# EAGLE schematic stm32f3driver3 (EAGLE 6.6.0)
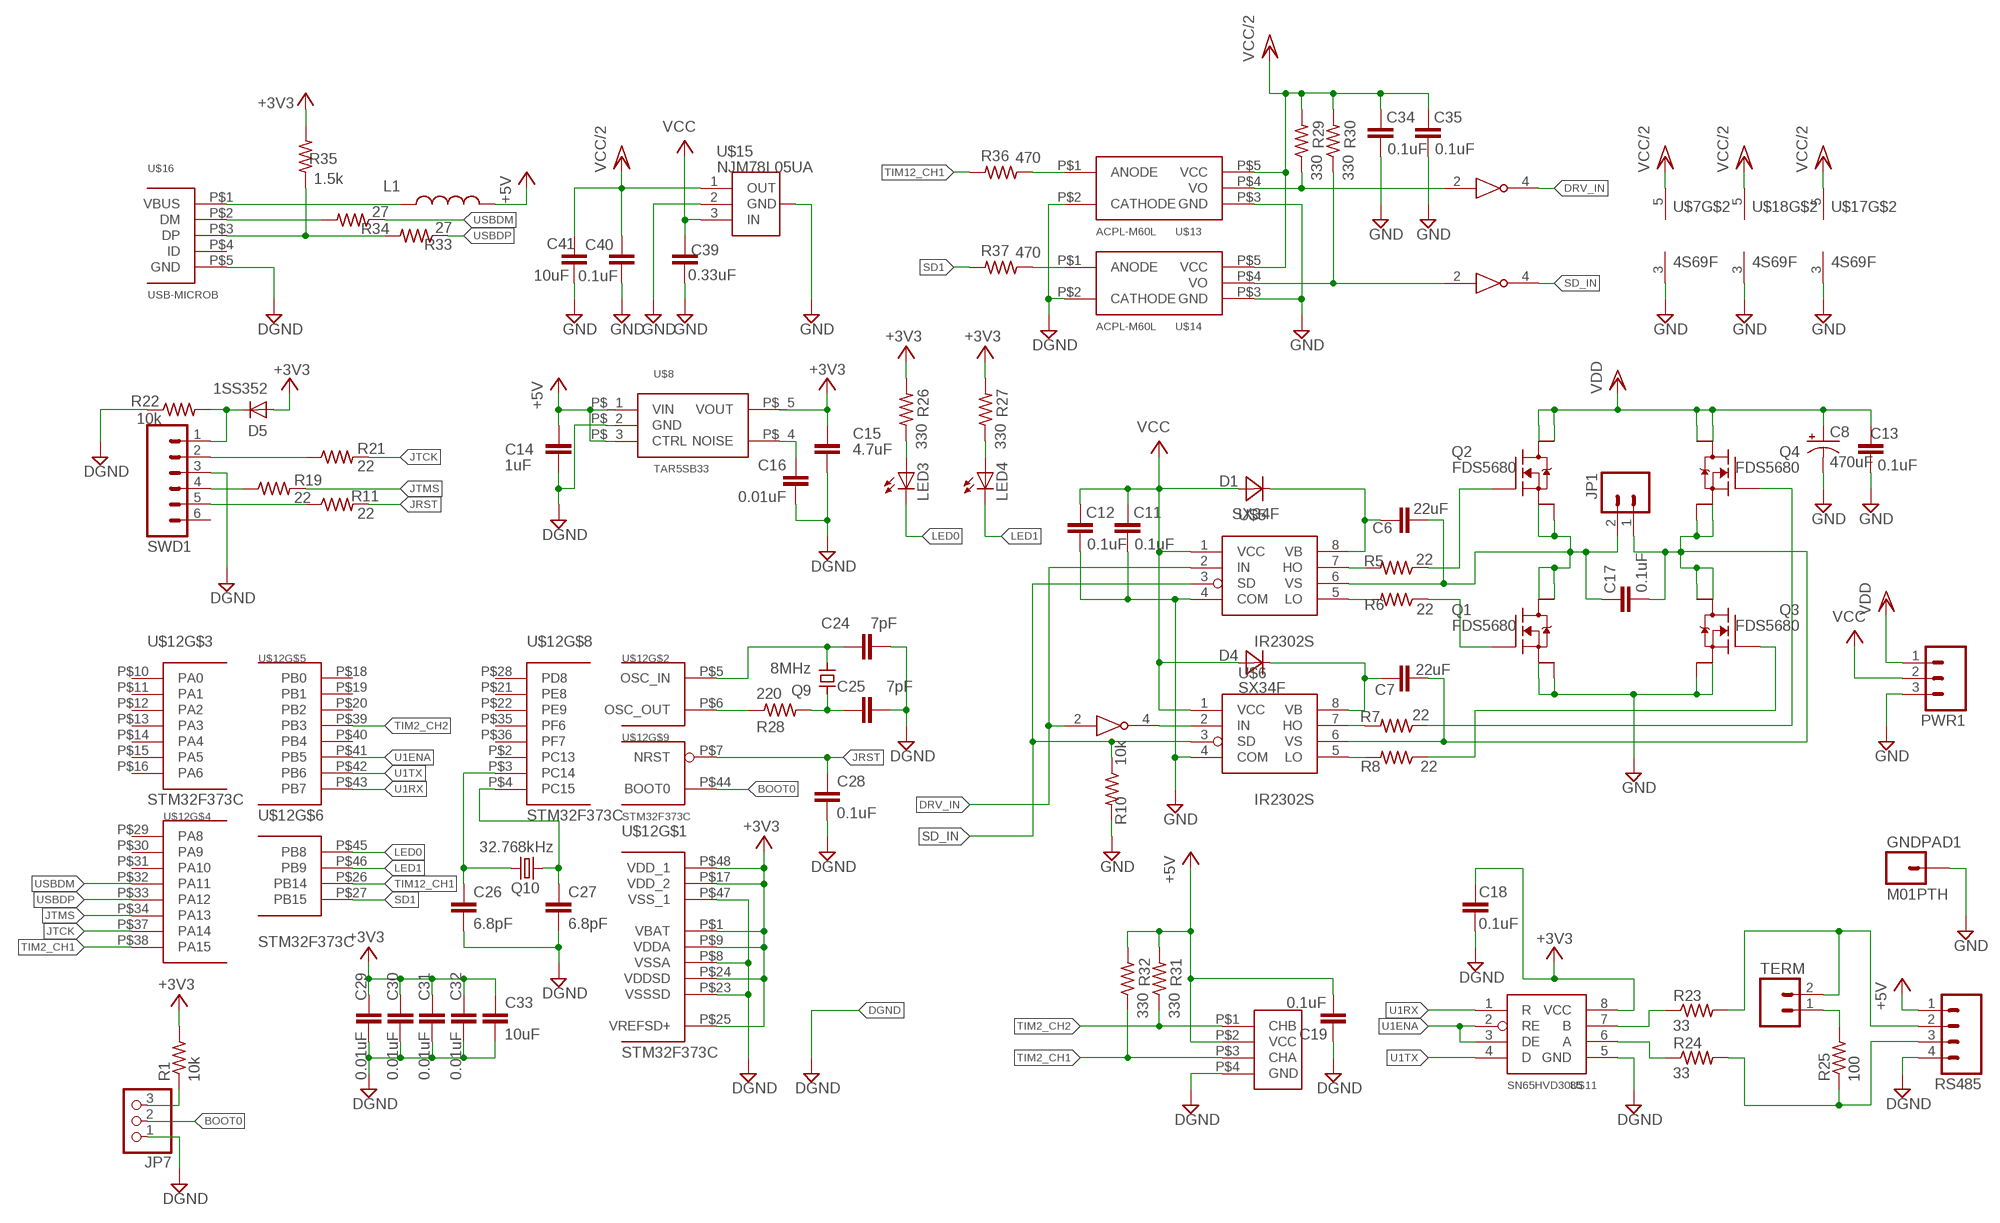
[diagram p0: schematic, sheet 1]

## Parts
C6  22uF  C-EUC3225  [C3225]
C7  22uF  C-EUC3225  [C3225]
C8  470uF  CPOL-USE5-10.5  [E5-10,5]
C11  0.1uF  C-EUC0603  [C0603]
C12  0.1uF  C-EUC0603  [C0603]
C13  0.1uF  C-EUC0603  [C0603]
C14  1uF  C-EUC2012  [C2012]
C15  4.7uF  C-EUC2012  [C2012]
C16  0.01uF  C-EUC0603  [C0603]
C17  0.1uF  C-EUC0603  [C0603]
C18  0.1uF  C-EUC1608  [C1608]
C19  0.1uF  C-EUC0603  [C0603]
C24  7pF  C-EUC0603  [C0603]
C25  7pF  C-EUC0603  [C0603]
C26  6.8pF  C-EUC0603  [C0603]
C27  6.8pF  C-EUC0603  [C0603]
C28  0.1uF  C-EUC0603  [C0603]
C29  0.01uF  C-EUC0603  [C0603]
C30  0.01uF  C-EUC0603  [C0603]
C31  0.01uF  C-EUC0603  [C0603]
C32  0.01uF  C-EUC0603  [C0603]
C33  10uF  C-EUC3216  [C3216]
C34  0.1uF  C-EUC0603  [C0603]
C35  0.1uF  C-EUC0603  [C0603]
C39  0.33uF  C-EUC0805  [C0805]
C40  0.1uF  C-EUC0603  [C0603]
C41  10uF  C-EUC3216  [C3216]
D1  SX34F  MBRA340T3  [SMA]
D4  SX34F  MBRA340T3  [SMA]
D5  1SS352  DIODESOD  [SOD-323]
GNDPAD1  M01PTH  [1X01]
JP1  M02PTH3  [1X02_LONGPADS]
JP7  PINHD-1X3  [1X03]
L1  L-USL3216C  [L3216C]
LED3  LED0603  [LED-0603]
LED4  LED0603  [LED-0603]
PWR1  M03LONGPADS  [1X03_LONGPADS]
Q1  FDS5680  [1206-8CHIP-FET]
Q2  FDS5680  [1206-8CHIP-FET]
Q3  FDS5680  [1206-8CHIP-FET]
Q4  FDS5680  [1206-8CHIP-FET]
Q9  8MHz  NX5032GA  [SMD5032]
Q10  32.768kHz  CRYSTALTC26H  [TC26H]
R1  10k  R-US_R0603  [R0603]
R5  22  R-US_R0603  [R0603]
R6  22  R-US_R0603  [R0603]
R7  22  R-US_R0603  [R0603]
R8  22  R-US_R0603  [R0603]
R10  10k  R-US_R0603  [R0603]
R11  22  R-US_R0603  [R0603]
R19  22  R-US_R0603  [R0603]
R21  22  R-US_R0603  [R0603]
R22  10k  R-US_R0603  [R0603]
R23  33  R-US_R0603  [R0603]
R24  33  R-US_R0603  [R0603]
R25  100  R-US_R0603  [R0603]
R26  330  R-US_R0603  [R0603]
R27  330  R-US_R0603  [R0603]
R28  220  R-US_R0603  [R0603]
R29  330  R-US_R0603  [R0603]
R30  330  R-US_R0603  [R0603]
R31  330  R-US_R0603  [R0603]
R32  330  R-US_R0603  [R0603]
R33  27  R-US_R0603  [R0603]
R34  27  R-US_R0603  [R0603]
R35  1.5k  R-US_R0603  [R0603]
R36  470  R-US_R0603  [R0603]
R37  470  R-US_R0603  [R0603]
RS485  M04PTH  [1X04]
SWD1  M06SIP  [1X06]
TERM  M02PTH  [1X02]
U$5  IR2302S  [SO8]
U$6  IR2302S  [SO8]
U$7  4S69F  [SOT23-5]
U$8  TAR5SB33  [TAR5SB33]
U$10  HEDS9701-C54  [HEDS9701]
U$11  SN65HVD3085  [SO8]
U$12  STM32F373C  [TQFP48]
U$13  ACPL-M60L  [SO5]
U$14  ACPL-M60L  [SO5]
U$15  NJM78L05UA  [SOT89]
U$16  USB-MICROB  [USB_MICROB]
U$17  4S69F  [SOT23-5]
U$18  4S69F  [SOT23-5]

## Nets
+3V3: C15.1 C18.1 C29.1 C30.1 C31.1 C32.1 C33.1 D5.2(A) R1.2 R26.2 R27.2 R35.2 U$8.P$_5(VOUT) U$11.8(VCC) U$12.P$1(VBAT) U$12.P$9(VDDA) U$12.P$17(VDD_2) U$12.P$24(VDDSD) U$12.P$25(VREFSD+) U$12.P$48(VDD_1)
+5V: C14.1 C19.2 L1.2 R31.2 R32.2 RS485.1 U$8.P$_1(VIN) U$8.P$_3(CTRL) U$10.P$2(VCC)
BOOT0: JP7.2 U$12.P$44(BOOT0)
DGND: C14.2 C15.2 C16.2 C18.2 C19.1 C24.2 C25.2 C26.2 C27.2 C28.2 C29.2 C30.2 C31.2 C32.2 C33.2 JP7.1 R22.1 RS485.4 SWD1.3 U$8.P$_2(GND) U$10.P$4(GND) U$11.5(GND) U$12.P$8(VSSA) U$12.P$23(VSSSD) U$12.P$47(VSS_1) U$13.P$2(CATHODE) U$14.P$2(CATHODE) U$16.P$5(GND)
DRV_IN: U$5.2(IN) U$7.2 U$17.4
GND: C8.- C11.2 C12.2 C13.2 C34.2 C35.2 C39.2 C40.2 C41.2 GNDPAD1.1 PWR1.3 Q1.1(S) Q1.2(S1) Q1.3(S2) Q3.1(S) Q3.2(S1) Q3.3(S2) R10.2 U$5.4(COM) U$6.4(COM) U$7.3(V-) U$13.P$3(GND) U$14.P$3(GND) U$15.2(GND) U$15.2@1(GND2) U$17.3(V-) U$18.3(V-)
JRST: C28.1 R11.2 U$12.P$7(NRST)
JTCK: R21.2 U$12.P$37(PA14)
JTMS: R19.2 U$12.P$34(PA13)
LED0: LED3.C U$12.P$45(PB8)
LED1: LED4.C U$12.P$46(PB9)
N$1: C7.1 D4.C U$6.8(VB)
N$3: C7.2 C17.2 JP1.1 Q3.5(D) Q3.6(D1) Q3.7(D2) Q3.8(D3) Q4.1(S) Q4.2(S1) Q4.3(S2) U$6.6(VS)
N$5: C6.2 C17.1 JP1.2 Q1.5(D) Q1.6(D1) Q1.7(D2) Q1.8(D3) Q2.1(S) Q2.2(S1) Q2.3(S2) U$5.6(VS)
N$6: C6.1 D1.C U$5.8(VB)
N$7: R5.2 U$5.7(HO)
N$10: R6.2 U$5.5(LO)
N$11: R7.2 U$6.7(HO)
N$13: R8.2 U$6.5(LO)
N$14: Q2.4(G) R5.1
N$15: Q4.4(G) R7.1
N$16: Q3.4(G) R8.1
N$17: U$6.2(IN) U$7.4
N$18: Q1.4(G) R6.1
N$19: D5.1(C) R22.2 SWD1.1
N$20: R21.1 SWD1.2
N$22: R19.1 SWD1.4
N$28: R11.1 SWD1.5
N$30: C16.1 U$8.P$_4(NOISE)
N$34: LED3.A R26.1
N$37: LED4.A R27.1
N$38: R23.1 U$11.7(B)
N$42: R24.1 U$11.6(A)
N$45: R24.2 R25.1 RS485.3
N$48: R23.2 RS485.2 TERM.2
N$49: R25.2 TERM.1
N$50: R28.1 U$12.P$6(OSC_OUT)
N$51: C25.1 Q9.P1 R28.2
N$52: C24.1 Q9.P2 U$12.P$5(OSC_IN)
N$53: C27.1 Q10.2 U$12.P$4(PC15)
N$54: C26.1 Q10.1 U$12.P$3(PC14)
N$55: R34.2 U$16.P$2(DM)
N$56: R33.2 R35.1 U$16.P$3(DP)
N$57: L1.1 U$16.P$1(VBUS)
N$58: R29.1 U$13.P$4(VO) U$17.2
N$59: R30.1 U$14.P$4(VO) U$18.2
N$60: R37.1 U$14.P$1(ANODE)
N$61: R36.1 U$13.P$1(ANODE)
N$66: JP7.3 R1.1
SD1: R37.2 U$12.P$27(PB15)
SD_IN: R10.1 U$5.3(SD) U$6.3(SD) U$18.4
TIM2_CH1: R32.1 U$10.P$3(CHA) U$12.P$38(PA15)
TIM2_CH2: R31.1 U$10.P$1(CHB) U$12.P$39(PB3)
TIM12_CH1: R36.2 U$12.P$26(PB14)
U1ENA: U$11.2(RE) U$11.3(DE) U$12.P$41(PB5)
U1RX: U$11.1(R) U$12.P$43(PB7)
U1TX: U$11.4(D) U$12.P$42(PB6)
USBDM: R34.1 U$12.P$32(PA11)
USBDP: R33.1 U$12.P$33(PA12)
VCC: C11.1 C12.1 C39.1 D1.A D4.A PWR1.2 U$5.1(VCC) U$6.1(VCC) U$15.3(IN)
VCC/2: C34.1 C35.1 C40.1 C41.1 R29.2 R30.2 U$7.5(V+) U$13.P$5(VCC) U$14.P$5(VCC) U$15.1(OUT) U$17.5(V+) U$18.5(V+)
VDD: C8.+ C13.1 PWR1.1 Q2.5(D) Q2.6(D1) Q2.7(D2) Q2.8(D3) Q4.5(D) Q4.6(D1) Q4.7(D2) Q4.8(D3)
Unconnected: SWD1.6 U$12.P$2(PC13) U$12.P$10(PA0) U$12.P$11(PA1) U$12.P$12(PA2) U$12.P$13(PA3) U$12.P$14(PA4) U$12.P$15(PA5) U$12.P$16(PA6) U$12.P$18(PB0) U$12.P$19(PB1) U$12.P$20(PB2) U$12.P$21(PE8) U$12.P$22(PE9) U$12.P$28(PD8) U$12.P$29(PA8) U$12.P$30(PA9) U$12.P$31(PA10) U$12.P$35(PF6) U$12.P$36(PF7) U$12.P$40(PB4) U$16.P$4(ID) U$16.P$6 U$16.P$7 U$16.P$8 U$16.P$9

## Library data of the parts
C6 C7 C11-C19 C24-C35 C39-C41 = rcl:C-EU: CAPACITOR, European symbol
C8 = rcl:CPOL-US: POLARIZED CAPACITOR, American symbol
D1 D4 = diode:MBRA340T3: Surface Mount Schottky Power Rectifier Source: http://www.onsemi.com/pub_link/Collateral/MBRA340T3-D.PDF
D5 = SparkFun:DIODE: Diode These are standard reverse protection diodes and small signal diodes. SMA package can handle up to about 1A. SOD-323 can handle about 200mA. What the SOD-323 package when ordering, there are some mfgs out there that are 5-pin packages.
GNDPAD1 = SparkFun:M01: Header 1 Standard 1-pin 0.1" header. Use with straight break away headers (SKU : PRT-00116), right angle break away headers (PRT-00553), swiss pins (PRT-00743), machine pins (PRT-00117), and female headers (PRT-00115).
JP1 TERM = SparkFun:M02: Header 2 Standard 2-pin 0.1" header. Use with straight break away headers (SKU : PRT-00116), right angle break away headers (PRT-00553), swiss pins (PRT-00743), machine pins (PRT-00117), and female headers (PRT-00115). Molex polarized connector foot print use with SKU : PRT-08233 with associated crimp pins and housings.
JP7 = mizdevice:PINHD-1X3: PIN HEADER
L1 = rcl:L-US: INDUCTOR, American symbol
LED3 LED4 = SparkFun:LED: LEDs Standard schematic elements and footprints for 5mm, 3mm, 1206, and 0603 sized LEDs. 5mm - Spark Fun Electronics SKU : COM-00529 (and others)
PWR1 = SparkFun:M03: Header 3 Standard 3-pin 0.1" header. Use with straight break away headers (SKU : PRT-00116), right angle break away headers (PRT-00553), swiss pins (PRT-00743), machine pins (PRT-00117), and female headers (PRT-00115). Molex polarized connector foot print use with SKU : PRT-08232 with associated crimp pins and housings.
Q1-Q4 = mizdevice:FDS5680: Single N-Channel 30-V (D-S) MOSFET Source: http://akizukidenshi.com/download/fds5680.pdf
Q9 = mizdevice:NX5032GA: NDK Crystal Units NX5032GA SMD5.0x 3.2mm
Q10 = crystal:CRYSTAL: CRYSTAL; OC_FARNELL: unknown; OC_NEWARK: unknown
R1 R5-R8 R10 R11 R19 R21-R37 = rcl:R-US_: RESISTOR, American symbol
RS485 = SparkFun:M04: Header 4 Standard 4-pin 0.1" header. Use with straight break away headers (SKU : PRT-00116), right angle break away headers (PRT-00553), swiss pins (PRT-00743), machine pins (PRT-00117), and female headers (PRT-00115). Molex polarized connector foot print use with SKU : PRT-08231 with associated crimp pins and housings. 1MM SMD Version SKU: PRT-10208
SWD1 = SparkFun:M06: Header 6 Standard 6-pin 0.1" header. Use with straight break away headers (SKU : PRT-00116), right angle break away headers (PRT-00553), swiss pins (PRT-00743), machine pins (PRT-00117), and female headers (PRT-00115). Molex polarized connector foot print use with SKU : PRT-08094 with associated crimp pins and housings. NOTES ON THE VARIANTS LOCK and LOCK_LONGPADS... This footprint was designed to help hold the alignment of a through-hole component (i.e. 6-pin header) while soldering it into place. You may notice that each hole has been shifted either up or down by 0.005 of an inch from it's more standard position (which is a perfectly straight line). This slight alteration caused the pins (the squares in the middle) to touch the edges of the holes. Because they are alternating, it causes a "brace" to hold the component in place. 0.005 has proven to be the perfect amount of "off-center" position when using our standard breakaway headers. Although looks a little odd when you look at the bare footprint, once you have a header in there, the alteration is very hard to notice. Also, if you push a header all the way into place, it is covered up entirely on the bottom side. This idea of altering the position of holes to aid alignment will be further integrated into the Sparkfun Library for other footprints. It can help hold any component with 3 or more connection pins.
U$5 U$6 = mizdevice:IR2302S: IR2302 Half Bridge Driver
U$7 U$17 U$18 = mizdevice:4S69F
U$8 = mizdevice:TAR5SB33: Toshiba TAR5SB33 3.3V Lowdrop Reg
U$10 = mizdevice:HEDS9701-C54: Avago Technology HEDS-9701 2ch Optical Encorder #C54 CPR100
U$11 = mizdevice:SN65HVD3085: Texas Instruments SN65HVD3085 RS422/485 Tranceiver
U$12 = mizdevice:STM32F373C: STMicro STM32F373C QFP48Pin MPU
U$13 U$14 = mizdevice:ACPL-M60L: Avago technology ACPL-M60L Highspeed Optocoupler
U$15 = mizdevice:NJM78L05UA: JRC 5V Voltage Regulator SOT-89
U$16 = mizdevice:USB-MICROB: Hirose ZX62R-B-5P SurfaceMount USB Micro-B Connector